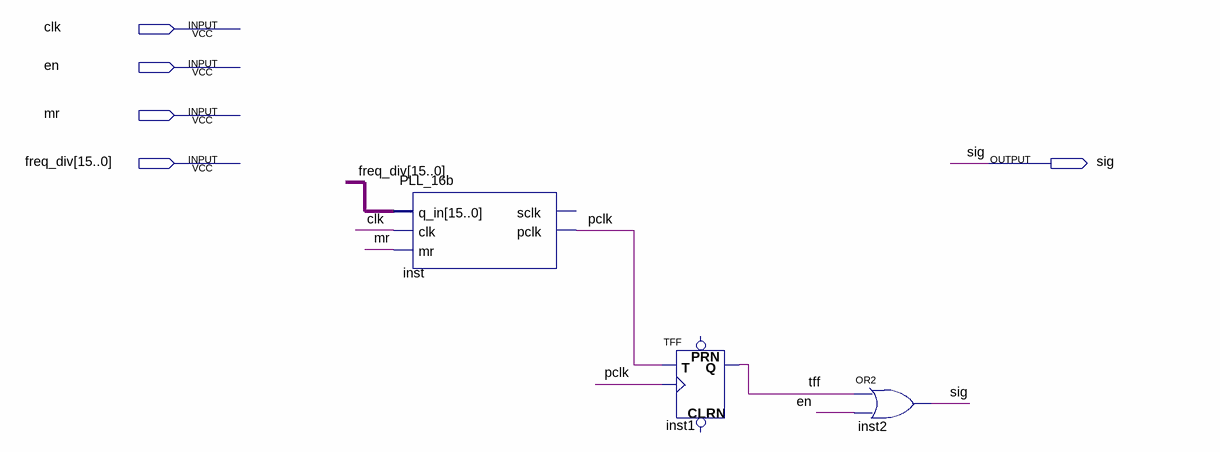
[diagram p0: schematic sheet]
// Quartus schematic PWM_Gen.bdf as structural Verilog: 3 symbols, 5 pins
module PWM_Gen (
  input  clk,
  input  en,
  input  mr,
  input  [15:0] freq_div,
  output sig
);

  wire pclk, tff;

  PLL_16b inst (.q_in(freq_div), .clk(clk), .mr(mr), .pclk(pclk));  // open: sclk
  TFF inst1 (.T(pclk), .CLK(pclk), .Q(tff));  // open: PRN, CLRN
  or inst2 (sig, tff, en);
endmodule
